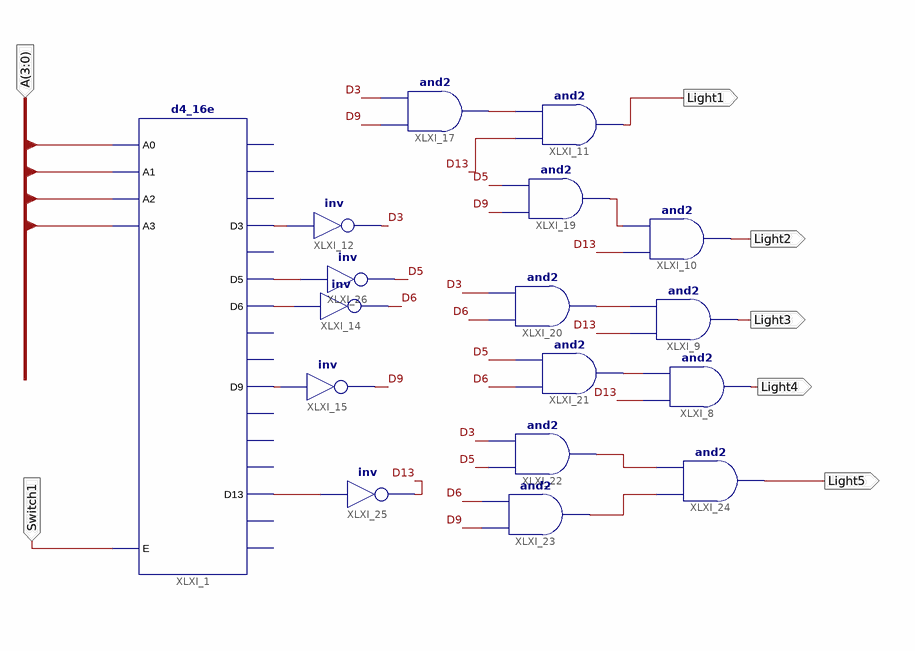
[diagram p0: schematic sheet 1]
// Xilinx ISE schematic Lab6_Ex1.sch (spartan3e) as structural Verilog: 17 symbols, 7 ports
module Lab6_Ex1 (
  input  [3:0] A,
  input  Switch1,
  output Light4,
  output Light3,
  output Light1,
  output Light2,
  output Light5
);

  wire D3, D5, D6, D9, D13, XLXN_51, XLXN_52, XLXN_53, XLXN_54, XLXN_56, XLXN_88, XLXN_93, XLXN_97, XLXN_111,
       XLXN_112, XLXN_126;

  d4_16e XLXI_1 (
    .A0(A[0]), .A1(A[1]), .A2(A[2]), .A3(A[3]), .E(Switch1), .D13(XLXN_56), .D3(XLXN_51), .D5(XLXN_52),
    .D6(XLXN_53), .D9(XLXN_54));  // open: D0, D1, D10, D11, D12, D14, D15, D2, D4, D7, D8
  and XLXI_9 (Light3, D13, XLXN_93);
  and XLXI_10 (Light2, D13, XLXN_88);
  and XLXI_11 (Light1, D13, XLXN_126);
  and XLXI_8 (Light4, D13, XLXN_97);
  not XLXI_12 (D3, XLXN_51);
  not XLXI_14 (D6, XLXN_53);
  not XLXI_15 (D9, XLXN_54);
  and XLXI_17 (XLXN_126, D9, D3);
  and XLXI_19 (XLXN_88, D9, D5);
  and XLXI_20 (XLXN_93, D6, D3);
  and XLXI_21 (XLXN_97, D6, D5);
  and XLXI_22 (XLXN_111, D5, D3);
  and XLXI_23 (XLXN_112, D9, D6);
  and XLXI_24 (Light5, XLXN_112, XLXN_111);
  not XLXI_25 (D13, XLXN_56);
  not XLXI_26 (D5, XLXN_52);
endmodule
